# EasyEDA Pro project ProPrj_LED_2025-06-07.epro

# Board LED
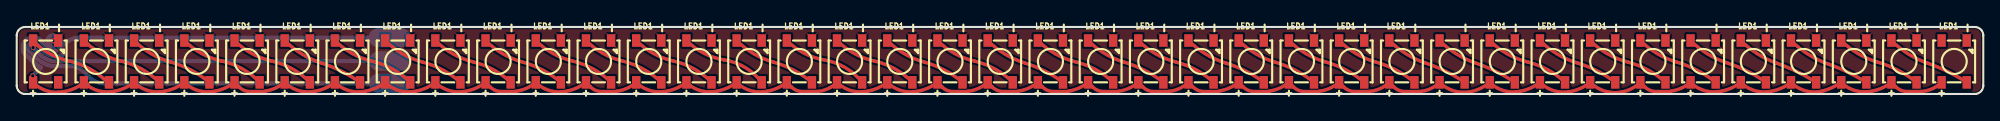
[diagram p0: board, top side]
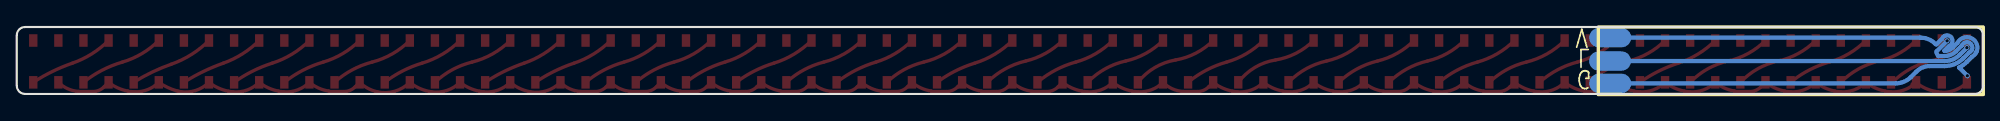
[diagram p1: board, bottom side, seen from below]

Outline 235 x 8 mm; copper layers: Top Layer, Bottom Layer. Coordinates in mm from the lower left corner of the outline.
Outline path: 0,7 0,1 arc(0.29,0.29) 1,0 234,0 arc(234.71,0.29) 235,1 235,7 arc(234.71,7.71) 234,8 1,8 arc(0.29,7.71) 0,7
Stack: Top Layer 0.035mm / Dielectric1 0.71mm FR4 er 4.5 / Bottom Layer 0.035mm

## Design rules (mm)
template: 自定义配置
spacing copperThickness1oz (default): track to track 0.1, other pairs 0.1 to 0.1
track width copperThickness1oz (default): min 0.1, default 0.2, max 2.54
track width copperThickness2oz: min 0.203, default 0.254, max 2.54
differential pair differentialPair (default): width min 0.127, default 0.254, max 2.54; gap min 0.152, default 0.152
via viaSize (default): diameter min 0.5, default 0.61, max 10; hole min 0.3, default 0.305, max 6.3

## Placement (name value [footprint] x y rotation side)
LED1  -  [LED-SMD_4P-L5.0-W5.0-BL_XL-5050RGBC]  9.52 3.89 0 top
LED1#2  -  [LED-SMD_4P-L5.0-W5.0-BL_XL-5050RGBC]  3.46 3.89 0 top
LED1#3  -  [LED-SMD_4P-L5.0-W5.0-BL_XL-5050RGBC]  15.52 3.89 0 top
LED1#4  -  [LED-SMD_4P-L5.0-W5.0-BL_XL-5050RGBC]  21.52 3.89 0 top
LED1#5  -  [LED-SMD_4P-L5.0-W5.0-BL_XL-5050RGBC]  27.52 3.89 0 top
LED1#6  -  [LED-SMD_4P-L5.0-W5.0-BL_XL-5050RGBC]  33.52 3.89 0 top
LED1#7  -  [LED-SMD_4P-L5.0-W5.0-BL_XL-5050RGBC]  39.53 3.89 0 top
LED1#8  -  [LED-SMD_4P-L5.0-W5.0-BL_XL-5050RGBC]  45.53 3.89 0 top
LED1#9  -  [LED-SMD_4P-L5.0-W5.0-BL_XL-5050RGBC]  51.53 3.89 0 top
LED1#10  -  [LED-SMD_4P-L5.0-W5.0-BL_XL-5050RGBC]  57.53 3.89 0 top
LED1#11  -  [LED-SMD_4P-L5.0-W5.0-BL_XL-5050RGBC]  63.53 3.89 0 top
LED1#12  -  [LED-SMD_4P-L5.0-W5.0-BL_XL-5050RGBC]  69.53 3.89 0 top
LED1#13  -  [LED-SMD_4P-L5.0-W5.0-BL_XL-5050RGBC]  75.53 3.89 0 top
LED1#14  -  [LED-SMD_4P-L5.0-W5.0-BL_XL-5050RGBC]  81.53 3.89 0 top
LED1#15  -  [LED-SMD_4P-L5.0-W5.0-BL_XL-5050RGBC]  87.53 3.89 0 top
LED1#16  -  [LED-SMD_4P-L5.0-W5.0-BL_XL-5050RGBC]  93.53 3.89 0 top
LED1#17  -  [LED-SMD_4P-L5.0-W5.0-BL_XL-5050RGBC]  99.53 3.89 0 top
LED1#18  -  [LED-SMD_4P-L5.0-W5.0-BL_XL-5050RGBC]  105.53 3.89 0 top
LED1#19  -  [LED-SMD_4P-L5.0-W5.0-BL_XL-5050RGBC]  111.53 3.89 0 top
LED1#20  -  [LED-SMD_4P-L5.0-W5.0-BL_XL-5050RGBC]  117.53 3.89 0 top
LED1#21  -  [LED-SMD_4P-L5.0-W5.0-BL_XL-5050RGBC]  123.53 3.89 0 top
LED1#22  -  [LED-SMD_4P-L5.0-W5.0-BL_XL-5050RGBC]  129.53 3.89 0 top
LED1#23  -  [LED-SMD_4P-L5.0-W5.0-BL_XL-5050RGBC]  135.53 3.89 0 top
LED1#24  -  [LED-SMD_4P-L5.0-W5.0-BL_XL-5050RGBC]  141.53 3.89 0 top
LED1#25  -  [LED-SMD_4P-L5.0-W5.0-BL_XL-5050RGBC]  147.53 3.89 0 top
LED1#26  -  [LED-SMD_4P-L5.0-W5.0-BL_XL-5050RGBC]  153.53 3.89 0 top
LED1#27  -  [LED-SMD_4P-L5.0-W5.0-BL_XL-5050RGBC]  159.53 3.89 0 top
LED1#28  -  [LED-SMD_4P-L5.0-W5.0-BL_XL-5050RGBC]  165.53 3.89 0 top
LED1#29  -  [LED-SMD_4P-L5.0-W5.0-BL_XL-5050RGBC]  171.53 3.89 0 top
LED1#30  -  [LED-SMD_4P-L5.0-W5.0-BL_XL-5050RGBC]  177.53 3.89 0 top
LED1#31  -  [LED-SMD_4P-L5.0-W5.0-BL_XL-5050RGBC]  183.53 3.89 0 top
LED1#32  -  [LED-SMD_4P-L5.0-W5.0-BL_XL-5050RGBC]  189.53 3.89 0 top
LED1#33  -  [LED-SMD_4P-L5.0-W5.0-BL_XL-5050RGBC]  195.53 3.89 0 top
LED1#34  -  [LED-SMD_4P-L5.0-W5.0-BL_XL-5050RGBC]  201.53 3.89 0 top
LED1#35  -  [LED-SMD_4P-L5.0-W5.0-BL_XL-5050RGBC]  207.53 3.89 0 top
LED1#36  -  [LED-SMD_4P-L5.0-W5.0-BL_XL-5050RGBC]  213.53 3.89 0 top
LED1#37  -  [LED-SMD_4P-L5.0-W5.0-BL_XL-5050RGBC]  219.53 3.89 0 top
LED1#38  -  [LED-SMD_4P-L5.0-W5.0-BL_XL-5050RGBC]  225.53 3.89 0 top
LED1#39  -  [LED-SMD_4P-L5.0-W5.0-BL_XL-5050RGBC]  231.53 3.89 0 top
NOREF  -  [Pad_e3859]  44.6 3.94 0 top
NOREF#2  -  [Pad_e305]  44.58 1.27 0 top
NOREF#3  -  [Pad_e306]  44.58 6.73 0 top

## Footprints (pads in the part's own frame, mm; a bottom-side part is the same pattern mirrored in y, then rotated)
LED-SMD_4P-L5.0-W5.0-BL_XL-5050RGBC
  rect 1x1.5 smd: 1(-1.5,-2.5) 2(1.5,-2.5) 3(1.5,2.5) 4(-1.5,2.5)
Pad_e305
  oval 5x2.3 smd far side: 1(0,0)
Pad_e306
  oval 5x2.3 smd far side: 2(0,0)
Pad_e3859
  rrect 5x2.3 smd far side: 1(0,0)

## Nets
GND: LED1.3 LED1#2.3 LED1#3.3 LED1#4.3 LED1#5.3 LED1#6.3 LED1#7.3 LED1#8.3 LED1#9.3 LED1#10.3 LED1#11.3 LED1#12.3 LED1#13.3 LED1#14.3 LED1#15.3 LED1#16.3 LED1#17.3 LED1#18.3 LED1#19.3 LED1#20.3 LED1#21.3 LED1#22.3 LED1#23.3 LED1#24.3 LED1#25.3 LED1#26.3 LED1#27.3 LED1#28.3 LED1#29.3 LED1#30.3 LED1#31.3 LED1#32.3 LED1#33.3 LED1#34.3 LED1#35.3 LED1#36.3 LED1#37.3 LED1#38.3 LED1#39.3 NOREF#2.1
VCC: LED1.1 LED1#2.1 LED1#3.1 LED1#4.1 LED1#5.1 LED1#6.1 LED1#7.1 LED1#8.1 LED1#9.1 LED1#10.1 LED1#11.1 LED1#12.1 LED1#13.1 LED1#14.1 LED1#15.1 LED1#16.1 LED1#17.1 LED1#18.1 LED1#19.1 LED1#20.1 LED1#21.1 LED1#22.1 LED1#23.1 LED1#24.1 LED1#25.1 LED1#26.1 LED1#27.1 LED1#28.1 LED1#29.1 LED1#30.1 LED1#31.1 LED1#32.1 LED1#33.1 LED1#34.1 LED1#35.1 LED1#36.1 LED1#37.1 LED1#38.1 LED1#39.1 NOREF#3.2

Pads without a net: LED1 2 4; LED1#2 2 4; LED1#3 2 4; LED1#4 2 4; LED1#5 2 4; LED1#6 2 4; LED1#7 2 4; LED1#8 2 4; LED1#9 2 4; LED1#10 2 4; LED1#11 2 4; LED1#12 2 4; LED1#13 2 4; LED1#14 2 4; LED1#15 2 4; LED1#16 2 4; LED1#17 2 4; LED1#18 2 4; LED1#19 2 4; LED1#20 2 4; LED1#21 2 4; LED1#22 2 4; LED1#23 2 4; LED1#24 2 4; LED1#25 2 4; LED1#26 2 4; LED1#27 2 4; LED1#28 2 4; LED1#29 2 4; LED1#30 2 4; LED1#31 2 4; LED1#32 2 4; LED1#33 2 4; LED1#34 2 4; LED1#35 2 4; LED1#36 2 4; LED1#37 2 4; LED1#38 2 4; LED1#39 2 4; NOREF 1

## Via types
v1: diameter 0.6, hole 0.4, Top Layer to Bottom Layer, 3 vias

## Routing (per net, layer and track width the routed paths; a pad name or vN(x,y) marks a point on that pad's centre or on a via; arc(x,y) is an arc through that point)
GND: length 52.3
  Bottom Layer w0.5: NOREF#2.1 10.45,1.27 arc(9.48,1.46) 8.65,2.01 7.99,2.67 arc(7.26,3.16) 6.4,3.34 4.61,3.34 arc(3.41,3.57) 2.39,4.26 1.71,4.94 arc(1.5,5.08) 1.36,5.29 arc(1.71,6.14) 2.56,5.79 3.24,5.1 arc(3.87,4.68) 4.61,4.54 5.37,4.54 arc(5.54,4.78) 5.59,5.07 v1(4.32,6.35)
VCC: length 304.2
  Top Layer w0.4: LED1.1 arc(8.18,1.24) 8.34,1.1 arc(9.62,0.42) 11.05,0.25 arc(11.22,0.27) 11.39,0.29 11.52,0.29 arc(11.62,0.3) 11.71,0.34 arc(12.93,0.73) LED1#3.1 arc(15.4,0.5) 17.02,0.25 arc(17.2,0.27) 17.38,0.29 17.52,0.29 arc(17.62,0.3) 17.71,0.34 arc(18.93,0.73) LED1#4.1 arc(21.39,0.51) 22.99,0.25 arc(23.18,0.27) 23.37,0.29 23.52,0.29 arc(23.62,0.3) 23.71,0.34 arc(24.93,0.73) LED1#5.1 26.58,0.84 arc(27.19,0.43) 27.91,0.29 29.52,0.29 arc(29.63,0.3) 29.72,0.35 arc(30.94,0.72) LED1#6.1 arc(33.42,0.49) 35.05,0.25 arc(35.22,0.27) 35.39,0.29 35.53,0.29 arc(35.62,0.3) 35.71,0.34 arc(36.93,0.73) LED1#7.1 arc(39.4,0.5) 41.02,0.25 arc(41.2,0.27) 41.38,0.29 41.53,0.29 arc(41.62,0.3) 41.71,0.34 arc(42.93,0.73) LED1#8.1 arc(45.39,0.51) 46.99,0.25 arc(47.18,0.27) 47.37,0.29 47.53,0.29 arc(47.62,0.3) 47.71,0.34 arc(48.93,0.73) LED1#9.1 arc(51.43,0.49) 53.09,0.25 arc(53.25,0.27) 53.41,0.29 53.53,0.29 arc(53.62,0.3) 53.7,0.33 arc(54.93,0.72) LED1#10.1 56.58,0.84 arc(57.19,0.43) 57.91,0.29 59.53,0.29 arc(59.61,0.3) 59.7,0.33 arc(60.94,0.69) LED1#11.1 arc(63.4,0.5) 65.02,0.25 arc(65.2,0.27) 65.38,0.29 65.53,0.29 arc(65.62,0.3) 65.71,0.34 arc(66.93,0.73) LED1#12.1 68.58,0.84 arc(69.19,0.43) 69.91,0.29 71.53,0.29 arc(71.6,0.3) 71.68,0.32 arc(72.93,0.68) LED1#13.1 arc(75.37,0.51) 76.96,0.25 arc(77.16,0.27) 77.36,0.29 77.53,0.29 arc(77.62,0.3) 77.71,0.34 arc(78.93,0.73) LED1#14.1 arc(81.36,0.52) 82.93,0.25 arc(83.14,0.27) 83.36,0.29 83.53,0.29 arc(83.62,0.3) 83.71,0.34 arc(84.93,0.73) LED1#15.1 arc(87.46,0.47) 89.15,0.25 arc(89.3,0.27) 89.45,0.29 89.53,0.29 arc(89.61,0.3) 89.69,0.33 arc(90.92,0.72) LED1#16.1 92.58,0.84 arc(93.19,0.43) 93.91,0.29 95.53,0.29 arc(95.56,0.29) 95.59,0.29 arc(96.91,0.62) LED1#17.1 arc(99.37,0.51) 100.97,0.25 arc(101.16,0.27) 101.36,0.29 101.53,0.29 arc(101.62,0.3) 101.71,0.34 arc(102.93,0.73) LED1#18.1 arc(105.42,0.49) 107.06,0.25 arc(107.23,0.27) 107.4,0.29 107.53,0.29 arc(107.62,0.3) 107.71,0.34 arc(108.93,0.72) LED1#19.1 110.58,0.84 arc(111.19,0.43) 111.91,0.29 113.53,0.29 arc(113.6,0.29) 113.67,0.32 arc(114.93,0.67) LED1#20.1 116.58,0.84 arc(117.19,0.43) 117.91,0.29 119.53,0.29 arc(119.62,0.3) 119.71,0.34 arc(120.94,0.71) LED1#21.1 122.58,0.84 arc(123.19,0.43) 123.91,0.29 125.53,0.29 arc(125.63,0.3) 125.72,0.35 arc(126.94,0.71) LED1#22.1 128.58,0.84 arc(129.19,0.43) 129.91,0.29 131.53,0.29 arc(131.61,0.3) 131.7,0.33 arc(132.94,0.69) LED1#23.1 134.58,0.84 arc(135.19,0.43) 135.91,0.29 137.53,0.29 arc(137.58,0.29) 137.62,0.3 arc(138.92,0.64) LED1#24.1 140.58,0.84 arc(141.19,0.43) 141.91,0.29 143.53,0.29 arc(143.64,0.31) 143.74,0.36 arc(144.95,0.73) LED1#25.1 146.58,0.84 arc(147.19,0.43) 147.91,0.29 149.53,0.29 arc(149.63,0.3) 149.72,0.35 arc(150.94,0.71) LED1#26.1 152.58,0.84 arc(153.19,0.43) 153.91,0.29 155.53,0.29 arc(155.61,0.3) 155.69,0.33 arc(156.94,0.69) LED1#27.1 158.58,0.84 arc(159.19,0.43) 159.91,0.29 161.53,0.29 arc(161.57,0.29) 161.62,0.3 arc(162.92,0.64) LED1#28.1 164.58,0.84 arc(165.19,0.43) 165.91,0.29 167.53,0.29 arc(167.56,0.29) 167.59,0.29 arc(168.91,0.61) LED1#29.1 arc(171.68,0.38) 173.61,0.25 arc(174.89,0.66) LED1#30.1 arc(177.48,0.47) 179.2,0.25 arc(179.33,0.27) 179.47,0.29 179.53,0.29 arc(179.6,0.3) 179.68,0.32 arc(180.92,0.71) LED1#31.1 arc(183.59,0.42) 185.42,0.25 arc(186.8,0.64) LED1#32.1 arc(189.82,0.33) 191.9,0.25 arc(193.04,0.67) LED1#33.1 194.58,0.84 arc(195.19,0.43) 195.91,0.29 197.53,0.29 arc(197.63,0.3) 197.72,0.34 arc(198.94,0.71) LED1#34.1 arc(201.43,0.49) 203.07,0.25 arc(203.24,0.27) 203.4,0.29 203.53,0.29 arc(203.62,0.3) 203.7,0.34 arc(204.93,0.72) LED1#35.1 arc(207.47,0.47) 209.17,0.25 arc(209.31,0.27) 209.46,0.29 209.53,0.29 arc(209.61,0.3) 209.69,0.33 arc(210.92,0.72) LED1#36.1 arc(213.62,0.42) 215.49,0.29 215.53,0.29 arc(215.61,0.3) 215.69,0.33 arc(215.79,0.35) 215.9,0.38 arc(217,0.8) LED1#37.1 arc(219.32,0.53) 220.85,0.25 arc(221.1,0.26) 221.35,0.29 221.53,0.29 arc(221.62,0.3) 221.71,0.34 arc(222.93,0.73) LED1#38.1 224.58,0.84 arc(225.19,0.43) 225.91,0.29 227.53,0.29 arc(227.57,0.29) 227.61,0.3 arc(228.91,0.63) LED1#39.1 ; 8.01,1.34 arc(6.91,0.68) 5.69,0.29 arc(5.6,0.25) 5.51,0.24 5.37,0.24 arc(5.2,0.22) 5.03,0.2 arc(3.6,0.37) 2.32,1.05
  Top Layer w0.6: 8.34,1.1 arc(8.37,1.12) 8.41,1.13
  Bottom Layer w0.5: NOREF#3.2 7.51,6.73 arc(6.54,6.54) 5.72,5.99 5.67,5.94 arc(5.62,5.93) 5.58,5.94 4.92,6.6 arc(4.78,6.81) 4.57,6.95 arc(3.72,6.6) 4.07,5.75 4.63,5.19 arc(4.63,5.16) 4.61,5.14 arc(4.1,5.24) 3.66,5.53 3.05,6.14 arc(1.42,6.67) 0.8,5.06 arc(1.02,4.71) 1.36,4.44 1.97,3.83 arc(2.4,3.46) 2.89,3.16 v1(1.91,2.17)
(no net): length 438.6
  Top Layer w0.3: LED1.4 arc(8.26,6.17) 8.49,5.95
  Top Layer w0.4: LED1#7.2 arc(38.82,2.71) 36.45,3.68 arc(34.08,4.77) LED1#6.4 ; LED1#35.2 arc(206.84,2.72) 204.47,3.68 arc(202.09,4.77) LED1#34.4 ; LED1#28.4 arc(166.06,4.78) 168.4,3.68 arc(170.79,2.7) LED1#29.2 ; LED1#29.4 arc(172.04,4.79) 174.37,3.68 arc(176.77,2.69) LED1#30.2 ; LED1#35.4 arc(208.02,4.8) 210.31,3.68 arc(212.73,2.67) LED1#36.2 ; LED1#23.4 arc(136.12,4.79) 138.56,3.81 arc(140.94,2.88) LED1#24.2 ; LED1#18.4 arc(106.07,4.81) 108.46,3.81 arc(110.87,2.85) LED1#19.2 ; LED1#8.2 arc(44.9,2.98) 42.42,3.94 arc(40.05,4.86) LED1#7.4 ; LED1#16.4 arc(94.09,4.88) 96.52,4.06 arc(99.02,3.14) LED1#17.2 ; LED1#11.2 arc(62.87,2.85) 60.45,3.81 arc(58.07,4.81) LED1#10.4 ; LED1#38.4 arc(226.03,4.79) 228.35,3.68 arc(230.76,2.68) LED1#39.2 ; LED1#9.4 arc(52.14,4.78) 54.61,3.81 arc(56.98,2.89) LED1#10.2 ; LED1#13.4 arc(76.08,4.85) 78.49,3.94 arc(80.94,3) LED1#14.2 ; LED1#22.4 arc(130.02,4.83) 132.33,3.81 arc(134.79,2.81) LED1#23.2 ; LED1#12.2 arc(68.9,2.98) 66.42,3.94 arc(64.05,4.86) LED1#11.4 ; LED1#32.4 arc(190.11,4.8) 192.53,3.81 arc(194.92,2.87) LED1#33.2 ; LED1#15.4 arc(88.06,4.82) 90.42,3.81 arc(92.85,2.84) LED1#16.2 ; LED1#20.4 arc(118.11,4.76) 120.52,3.68 arc(122.87,2.73) LED1#21.2 ; LED1#4.2 arc(20.85,2.84) 18.41,3.81 arc(16.06,4.82) LED1#3.4 ; LED1#17.4 arc(100.08,4.84) 102.49,3.94 arc(104.94,3) LED1#18.2 ; LED1#12.4 arc(70.04,4.86) 72.39,3.94 arc(74.88,2.97) LED1#13.2 ; LED1#32.2 arc(188.9,2.74) 186.56,3.68 arc(184.13,4.75) LED1#31.4 ; LED1#4.4 arc(22.09,4.84) 24.51,3.94 arc(26.96,3) LED1#5.2 ; LED1#37.2 arc(218.84,2.6) 216.53,3.55 arc(214.12,4.72) LED1#36.4 ; LED1#27.4 arc(160.06,4.82) 162.43,3.81 arc(164.86,2.84) LED1#28.2 ; LED1#22.2 arc(128.98,2.89) 126.62,3.81 arc(124.14,4.78) LED1#21.4 ; LED1#25.2 arc(146.88,2.73) 144.53,3.68 arc(142.11,4.76) LED1#24.4 ; LED1#5.4 arc(28.08,4.85) 30.48,3.94 arc(32.94,2.99) LED1#6.2 ; LED1#27.2 arc(158.88,2.85) 156.46,3.81 arc(154.08,4.81) LED1#26.4 ; LED1#31.2 arc(182.97,2.89) 180.59,3.81 arc(178.13,4.79) LED1#30.4 ; 2.32,5.95 arc(4.18,4.7) 6.28,3.94 arc(8.75,2.99) 10.86,1.39 ; LED1#37.4 arc(220.04,4.83) 222.38,3.81 arc(224.82,2.83) LED1#38.2 ; LED1#20.2 arc(116.9,2.98) 114.43,3.94 arc(112.06,4.86) LED1#19.4 ; LED1#26.2 arc(152.81,2.82) 150.37,3.81 arc(148.03,4.83) LED1#25.4 ; LED1#3.2 arc(14.91,2.99) 12.45,3.94 arc(10.35,4.7) 8.49,5.95 arc(8.26,6.17) LED1.4 ; LED1#8.4 arc(46.1,4.8) 48.51,3.81 arc(50.91,2.86) LED1#9.2 ; LED1#14.4 arc(82.12,4.87) 84.58,4.06 arc(87.06,3.16) LED1#15.2 ; LED1#34.2 arc(200.82,2.83) 198.37,3.81 arc(196.04,4.83) LED1#33.4
  Bottom Layer w0.5: v1(1.96,5.54) 2.82,4.68 arc(3.64,4.13) 4.61,3.94 NOREF.1

## Copper pours and planes (outline as drawn; the poured copper is in the pictures)
GND on Top Layer: -5.21,9.35 234.83,9.35 234.83,-1.46 -5.21,-1.46

## Text on the board
Bottom Silkscreen Layer: L | G | V

# Board Esp32c3
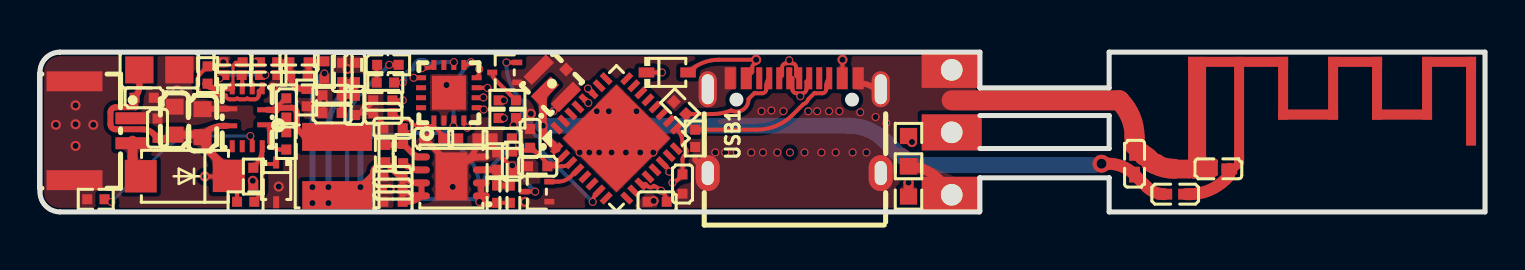
[diagram p2: board, top side]
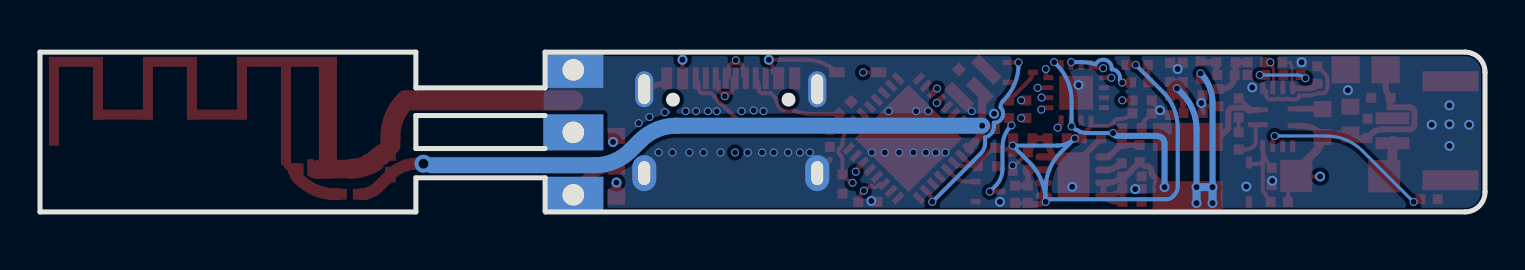
[diagram p3: board, bottom side, seen from below]

Outline 72.26 x 8 mm; copper layers: Top Layer, Inner1, Inner2, Bottom Layer. Coordinates in mm from the lower left corner of the outline.
Outline path: 47,3.17 53.47,3.17 53.47,4.83 47,4.83 ; 0,7 arc(0.29,7.71) 1,8 47.01,8 47.01,6.22 arc(47.01,6.21) 47,6.21 53.47,6.21 53.47,8 72.26,8 72.26,0 53.47,0 53.47,1.71 47,1.71 47,0.04 arc(47,0.02) 46.98,0 1,0 arc(0.29,0.29) 0,1 0,7
Stack: Top Layer 0.035mm 外层铜厚1oz / Dielectric1 0.2133mm 7628 RC49% 8.6mil / Inner1 0.035mm 内层铜厚 / Dielectric2 0.2133mm 1.1mm H/HOZ Copper / Inner2 0.035mm 内层铜厚 / Dielectric3 0.2133mm 7628 RC49% 8.6mil / Bottom Layer 0.035mm 外层铜厚1oz

## Design rules (mm)
net DATA+: DP1
net DATA-: DP1
net TX: DP2
net RX: DP2
template: 自定义配置
spacing copperThickness1oz: track to track 0.102, other pairs 0.152 to 0.3
spacing copperThickness2oz (default): track to track 0.1, other pairs 0.1 to 0.3
track width copperThickness1oz: min 0.1, default 0.254, max 2.54
track width copperThickness2oz (default): min 0.1, default 0.254, max 2.54
differential pair differentialPair (default): width min 0.127, default 0.254, max 2.54; gap min 0.152, default 0.152
via viaSize (default): diameter min 0.5, default 0.61, max 10; hole min 0.3, default 0.305, max 6.3

## Placement (name value [footprint] x y rotation side)
C2  22uF  [C0805]  5.97 7.11 0 top
C3  -  [C0402]  5.21 5.71 180 top
C3#2  -  [C0402]  5.88 4.19 270 top
C4  -  [C0603]  6.73 4.57 90 top
C4#2  -  [C0603]  8.13 4.44 90 top
C5  1uF  [C0402]  9.65 7.49 0 top
C6  100nF  [C0402]  12.32 5.21 270 top
C7  100nF  [C0402]  12.95 7.49 0 top
C8  22uF  [C0402]  15.75 5.33 270 top
C9  22uF  [C0402]  14.6 5.84 0 top
C10  22uF  [C0402]  14.6 4.95 0 top
C11  22uF  [C0402]  15.11 6.98 90 top
C12  22uF  [C0402]  15.75 6.98 90 top
C13  1nF  [C0402]  18.16 2.92 90 top
C14  4.7uF  [C0402]  17.65 1.78 0 top
C15  2.2uF  [C0402]  17.65 1.14 0 top
C16  2.2uF  [C0402]  17.65 0.51 0 top
C17  -  [C0402]  23.11 3.68 0 top
C17#2  -  [C0402]  17.15 4.94 0 top
C17#3  -  [C0402]  17.14 5.59 0 top
C18  -  [C0402]  23.62 2.54 90 top
C18#2  -  [C0402]  17.65 4.19 0 top
C19  -  [C0402]  19.68 3.68 0 top
C19#2  -  [C0402]  24.89 2.29 0 top
C19#3  -  [C0402]  24.51 3.68 270 top
C20  -  [C0402]  21.4 3.68 180 top
C20#2  -  [C0402]  32.13 1.4 90 top
C21  100nF  [C0402]  30.86 0.51 0 top
C22  2.4pF  [C0402#2]  58.93 2.16 0 top
C23  8.2pF  [C0402#2]  54.74 2.41 90 top
CN1  WAFER-GH1.25-2PWB  [CONN-TH_2P-P1.25_XUNPU_WAFER-GH1.25-2PWB]  3.17 4.06 270 top
D1  B5819WS  [SOD-323_L1.7-W1.3-LS2.5-FD]  31.37 6.98 180 top
D2  SS34  [SMA_L4.3-W2.6-LS5.0-FD]  7.24 1.79 0 top
D3  BZT52C5V1S-7-F  [SOD-323_L1.8-W1.3-LS2.5-RD]  11.81 1.52 270 top
L1  15uH  [IND-SMD_L4.0-W4.0]  14.86 2.29 270 top
L2  1.5nH  [L0402]  56.77 0.89 0 top
LED1  NCD0402G1  [LED0402-RD]  17.4 7.37 0 top
NOREF  -  [Pad_e1279]  45.59 7.11 270 top
NOREF#2  -  [Pad_e1296]  45.59 0.86 270 top
NOREF#3  -  [Pad_e1295]  45.59 3.98 270 top
Q2  MMBT2222ATT1G  [SC-75-3_L1.6-W0.8-P1.00-LS1.6-BR]  23.24 6.98 0 top
Q3  MMBT2222ATT1G  [SC-75-3_L1.6-W0.8-P1.00-LS1.6-BR]  24.85 1.02 0 top
R3  -  [R0402]  8.38 6.86 90 top
R3#2  -  [R0402]  10.29 0.51 0 top
R4  20kΩ  [R0402]  10.67 1.78 90 top
R5  0Ω  [R0402]  12.32 3.56 90 top
R6  20kΩ  [R0402]  11.43 7.49 0 top
R7  41.2kΩ  [R0402]  12.95 6.86 0 top
R8  7.68kΩ  [R0402]  13.33 5.72 270 top
R9  10Ω  [R0402]  14.22 7.11 270 top
R10  10Ω  [R0402]  9.65 6.86 180 top
R11  76.8kΩ  [R0402]  11.44 6.86 0 top
R12  100kΩ  [R0402]  2.79 0.63 0 top
R13  100kΩ  [R0402]  17.27 2.92 90 top
R14  -  [R0402]  22.86 2.55 90 top
R14#2  -  [R0402]  23.37 5.59 180 top
R15  -  [R0402]  23.49 0.89 90 top
R15#2  -  [R0402]  23.37 4.7 180 top
R16  -  [R0402]  22.86 0.89 90 top
R16#2  -  [R0402]  17.27 6.48 0 top
R17  5.1kΩ  [R0402]  32 5.21 135 top
R18  5.1kΩ  [R0402]  32.77 3.68 90 top
R19  0Ω  [R0603]  43.43 3.05 90 top
R20  0Ω  [R0603]  43.43 1.52 90 top
RF1  KH-IPEX4-2020  [IPEX4-SMD_4P-L1.8-W1.7-LS2.0-L_KH-IPEX4-2020]  25.78 6.6 45 top
U1  MP4573GQBE-Z  [QFN-12_L3.0-W2.5-P0.5_MPQ4572]  10.41 4.74 180 top
U2  MP20051DQ-LF-Z  [TDFN-8_L3.0-W3.0-P0.65-BL-EP]  20.57 1.78 90 top
U3  CH343P  [TQFN-16_L3.0-W3.0-P0.50-BL-EP1.7]  20.45 5.97 0 top
U4  ESP32-C3  [QFN-32_L5.0-W5.0-P0.50-TL-EP3.7]  28.83 3.68 45 top
U5  天线  [2.4Ghz平面倒F天线]  64.52 5.46 0 top
USB1  TYPE-C 16PIN 2MD(073)  [USB-C-SMD_TYPE-C-6PIN-2MD-073]  37.72 4.32 0 top

## Footprints (pads in the part's own frame, mm; a bottom-side part is the same pattern mirrored in y, then rotated)
2.4Ghz平面倒F天线
  rect 0.9x0.5 smd: 1(-6.651,-2.846)
  rect 0.5x0.5 smd: 2(-4.551,-2.846)
C0402
  rect 0.5x0.5 smd: 1(-0.481,0) 2(0.481,0)
C0402#2
  rect 0.79x0.54 smd: 1(-0.545,0) 2(0.545,0)
C0603
  rect 0.8x0.9 smd: 1(-0.7,0) 2(0.7,0)
C0805
  rect 1.41x1.35 smd: 1(-1,0) 2(1,0)
CONN-TH_2P-P1.25_XUNPU_WAFER-GH1.25-2PWB
  rect 0.6x1.7 smd: 1(-0.625,1.45) 2(0.625,1.45)
  rect 1x2.8 smd: 3(-2.475,-1.45) 4(2.475,-1.45)
IND-SMD_L4.0-W4.0
  rect 1.4x3.5 smd: 1(-1.47,0) 2(1.444,0.009)
IPEX4-SMD_4P-L1.8-W1.7-LS2.0-L_KH-IPEX4-2020
  rect 1.4x0.6 smd: 1(-0.748,0)
  rect 1.58x0.58 smd: 2(-0.228,-0.96) 4(-0.228,0.96)
  rect 0.5x0.5 smd: 3(0.748,0)
L0402
  rect 0.79x0.54 smd: 1(-0.545,0) 2(0.545,0)
LED0402-RD
  rect 0.5x0.5 smd: 1(-0.538,0) 2(0.538,0)
Pad_e1279
  rect 1.8x3 hole 1.08: 1(0,0)
Pad_e1295
  rect 1.8x3 hole 1.08: 2(0,0)
Pad_e1296
  rect 1.8x3 hole 1.08: 3(0,0)
QFN-12_L3.0-W2.5-P0.5_MPQ4572
  rect 1x0.25 smd: 1(-0.95,0.375) 2(-0.95,-0.375) 7(1.05,-0.425) 8(1.05,0.425)
  rect 0.25x0.6 smd: 3(-0.7,-1.45) 4(-0.2,-1.45) 5(0.3,-1.45) 6(0.8,-1.45) 9(0.8,1.45) 10(0.3,1.45) 11(-0.2,1.45) 12(-0.7,1.45)
QFN-32_L5.0-W5.0-P0.50-TL-EP3.7
  rect 0.65x0.28 smd: 1(-2.478,1.75) 2(-2.478,1.25) 3(-2.478,0.75) 4(-2.478,0.25) 5(-2.478,-0.25) 6(-2.478,-0.75) 7(-2.478,-1.25) 8(-2.478,-1.75) 17(2.478,-1.75) 18(2.478,-1.25) 19(2.478,-0.75) 20(2.478,-0.25) 21(2.478,0.25) 22(2.478,0.75) 23(2.478,1.25) 24(2.478,1.75)
  rect 0.28x0.65 smd: 9(-1.75,-2.478) 10(-1.25,-2.478) 11(-0.75,-2.478) 12(-0.25,-2.478) 13(0.25,-2.478) 14(0.75,-2.478) 15(1.25,-2.478) 16(1.75,-2.478) 25(1.75,2.478) 26(1.25,2.478) 27(0.75,2.478) 28(0.25,2.478) 29(-0.25,2.478) 30(-0.75,2.478) 31(-1.25,2.478) 32(-1.75,2.478)
  rect 3.8x3.8 smd: 33(0,0)
R0402
  rect 0.5x0.5 smd: 1(-0.433,0) 2(0.433,0)
R0603
  rect 0.806x0.864 smd: 1(-0.753,0) 2(0.753,0)
SC-75-3_L1.6-W0.8-P1.00-LS1.6-BR
  rect 0.5x0.28 smd: 1(0.625,-0.5) 2(0.625,0.5) 3(-0.625,0)
SMA_L4.3-W2.6-LS5.0-FD
  rect 1.6x1.62 smd: 1(-2.201,-0.009) 2(2.201,0.009)
SOD-323_L1.7-W1.3-LS2.5-FD
  rect 0.78x0.5 smd: 1(-1.04,0) 2(1.04,0)
SOD-323_L1.8-W1.3-LS2.5-RD
  rect 0.6x0.3 smd: 1(-0.952,-0.002) 2(1.04,0)
TDFN-8_L3.0-W3.0-P0.65-BL-EP
  oval 0.35x0.84 smd: 1(-0.975,-1.495) 2(-0.325,-1.495) 3(0.325,-1.495) 4(0.975,-1.495) 5(0.975,1.495) 6(0.325,1.495) 7(-0.325,1.495) 8(-0.975,1.495)
  rect 2.4x1.6 smd: 9(0,0)
TQFN-16_L3.0-W3.0-P0.50-BL-EP1.7
  rect 0.25x0.5 smd: 1(-0.749,-1.39) 2(-0.248,-1.39) 3(0.252,-1.39) 4(0.751,-1.39) 9(0.75,1.39) 10(0.25,1.39) 11(-0.25,1.39) 12(-0.749,1.39)
  rect 0.5x0.25 smd: 5(1.39,-0.75) 6(1.39,-0.25) 7(1.39,0.25) 8(1.39,0.75) 13(-1.39,0.75) 14(-1.39,0.25) 15(-1.39,-0.25) 16(-1.39,-0.75)
  rect 1.7x1.7 smd: 17(0.001,0)
USB-C-SMD_TYPE-C-6PIN-2MD-073
  rect 0.55x1.1 smd: 1(-3.2,2.375) 2(-2.4,2.375) 11(2.4,2.375) 12(3.2,2.375)
  rect 0.3x1.1 smd: 3(-1.75,2.375) 4(-1.25,2.375) 5(-0.75,2.375) 6(-0.25,2.375) 7(0.25,2.375) 8(0.75,2.375) 9(1.25,2.375) 10(1.75,2.375)
  oval 0.9x1.8 hole 0.6x1.5: 13(-4.325,1.825) 14(4.325,1.825)
  oval 1.2x1.8 hole 0.6x1.2: 13(-4.325,-2.375) 14(4.325,-2.375)

## Nets
GND: C2.2 C3.1 C3#2.1 C4.2 C4#2.2 C5.1 C8.2 C9.1 C10.1 C11.2 C12.2 C14.1 C15.1 C16.1 C17.1 C17#2.1 C17#3.1 C18.1 C18#2.1 C19.1 C19#2.1 C19#3.1 C20.1 C20#2.1 C21.1 C22.1 C23.2 CN1.1 CN1.3 CN1.4 D3.2 NOREF.1 Q2.1 Q3.1 R4.1 R8.2 R11.2 R12.1 R14.2 R17.2 R18.1 RF1.2 RF1.3 RF1.4 U1.7 U2.4 U2.9 U3.2 U3.17 U4.33 U5.1 USB1.1 USB1.12 USB1.13 USB1.14
V3: C17#3.2 U3.6
VCC: CN1.2 D2.1
VCC-5V: D1.1 USB1.2 USB1.11
VCC-M: C5.2 R3.1 U1.6
VIN-DC: C2.1 C3.2 C3#2.2 C4.1 C4#2.1 D1.2 D2.2 R3#2.1 U1.8
ACT#: R16#2.2 U3.10
B1: Q2.3 R14#2.1
B2: Q3.3 R15#2.1
BST: R5.1 U1.1
CC1: R17.1 USB1.4
CC2: R18.2 USB1.10
CCM: R12.2 U1.11
CR1: C6.2 R5.2
DATA+: U3.7 USB1.6 USB1.8
DATA-: U3.8 USB1.5 USB1.7
DTR: R14#2.2 U3.12
EN: D3.1 R3#2.2 R4.2 U1.12
EN1: C13.2 R13.2 U2.5
EN-ESP: Q2.2 U4.7
FB: R6.1 U1.4
FB1: R14.1 R15.2 R16.2 U2.3
FREQ: R10.1 U1.5
GPIO0: Q3.2 U4.4
LAN-IN: C22.2 C23.1 L2.1 L2.2 RF1.1 U4.1 U5.2
LC: NOREF#3.2 U4.14
LED: LED1.1 R16#2.1
NC: U1.9 U1.10
NC1: C13.1 U2.6
OUT-3.3V: C17.2 C17#2.2 C18.2 C19.2 C19#2.2 C19#3.2 C20.2 C20#2.2 C21.2 LED1.2 R15.1 R16.1 R19.2 U2.1 U2.2 U3.1 U4.2 U4.3 U4.11 U4.17
PG: R3.2 U1.3
R3: C7.2 R7.2 R9.1
R6: C7.1 R6.2 R7.1 R8.1
R7: R10.2 R11.1
RTS: R15#2.2 U3.13
RX: U3.5 U4.27
S1: USB1.3
S2: USB1.9
SW: C6.1 L1.1 U1.2
TX: U3.4 U4.28
V: NOREF#2.3 R19.1 R20.2
VOUT-5V: C8.1 C9.2 C10.2 C11.1 C12.1 C14.2 C15.2 C16.2 C18#2.2 L1.2 R9.2 R13.1 R20.1 U2.7 U2.8 U3.3 U3.9

Pads without a net: U3 11 14 15 16; U4 5 6 8 9 10 12 13 15 16 18 19 20 21 22 23 24 25 26 29 30 31 32

## Via types
v1: diameter 0.4, hole 0.3, Top Layer to Bottom Layer, 34 vias
v2: diameter 0.5, hole 0.305, Top Layer to Bottom Layer, 30 vias
v3: diameter 0.4, hole 0.305, Top Layer to Bottom Layer, 38 vias
v4: diameter 0.9, hole 0.5, Top Layer to Bottom Layer, 1 via

## Routing (per net, layer and track width the routed paths; a pad name or vN(x,y) marks a point on that pad's centre or on a via; arc(x,y) is an arc through that point)
GND: length 44.2
  Top Layer w0.2: C22.1 58.74,2.51 ; C22.1 arc(58.24,2.04) 58.09,1.94 ; C22.1 arc(58.07,2.1) 57.8,1.92 ; C22.1 arc(58.44,2.07) 58.46,1.97 58.46,1.91 ; 58.74,2.51 58.64,2.51 ; 58.74,2.51 arc(58.77,2.53) 58.8,2.54 ; 58.8,2.54 58.66,2.54 arc(58.65,2.53) 58.64,2.51 ; 58.8,2.54 58.8,1.91 ; 56.71,2.16 56.83,2.04 arc(56.98,1.94) 57.15,1.91 57.77,1.91 arc(57.78,1.91) 57.8,1.92 ; 58.8,1.91 58.46,1.91 ; 58.8,1.91 arc(58.64,1.8) 58.46,1.76 ; 58.8,1.91 arc(58.62,1.87) 58.46,1.76 ; 58.46,1.91 58.17,1.91 arc(58.13,1.91) 58.09,1.94 ; 58.46,1.91 58.46,1.76 ; R8.2 13.79,5.29 arc(14,5.33) v2(14.19,5.45) ; v2(14.19,5.45) 14.19,5.69 arc(14.17,5.77) C9.1 ; v2(14.19,5.45) 14.19,5.1 arc(14.17,5.02) C10.1 ; v2(16.25,5.09) 16.21,5.04 arc(16,4.9) C8.2 ; v2(16.25,5.09) 16.3,5.09 arc(16.5,5.05) C17#2.1 17,4.6 arc(17.13,4.41) C18#2.1 ; v2(16.25,5.09) 16.6,5.44 arc(16.65,5.51) C17#3.1 ; 58.46,1.76 57.69,1.76 arc(57.67,1.77) 57.66,1.78 ; 58.64,2.51 arc(58.53,2.41) 58.39,2.35 ; 56.77,1.78 57.46,1.78 arc(57.79,1.82) 58.09,1.94 ; 57.8,1.92 57.78,1.91 ; R14.2 23.51,2.33 arc(23.59,2.21) C18.1
  Top Layer w0.3: 32.77,2.61 32.91,2.47 arc(33.27,1.94) 33.39,1.31 ; U1.7 8.39,5.16 arc(8.25,5.19) 8.13,5.27 ; 42.04,5.89 41.85,6.08 arc(41.46,6.35) 40.99,6.44 40.92,6.44 ; 21.18,2.39 21.45,2.66 arc(21.77,3.13) C20.1 C17.1 22.63,3.53 arc(22.69,3.23) R14.2 ; 21.18,2.39 U2.9 arc(20.48,2.27) 20.2,2.69 C19.1 ; 21.18,2.39 arc(21.59,2.66) U2.4
  Top Layer w0.4: 54.74,2.88 54.74,3.34 ; 58.38,2.41 55.83,2.41 55.57,2.16 C22.1
  Top Layer w1: 45.59,5.59 53.98,5.59 53.99,5.57 arc(54.54,4.75) 54.74,3.77 54.74,3.34 ; 55.12,2.92 55.21,2.83 arc(55.41,2.71) 55.54,2.53 ; 55.7,2.43 arc(55.63,2.46) 55.56,2.49 arc(55.55,2.51) 55.54,2.53 ; 55.7,2.43 arc(55.62,2.48) 55.54,2.53 ; 55.7,2.43 arc(55.77,2.42) 55.83,2.41 ; 55.7,2.43 arc(55.75,2.4) 55.79,2.38 arc(56.24,2.21) 56.71,2.16
  vias: v1(23.62,2.33) v1(25.67,5.04) v1(26.99,2.98) v1(27.47,2.98) v1(27.85,5.04) v1(27.96,2.98) v1(28.45,5.04) v1(28.58,2.98) v1(29.3,2.98) v1(29.83,5.04) v1(30.02,2.98) v1(30.67,2.98) v1(33.77,2.98) v1(34.26,2.98) v1(34.85,2.98) v1(35.57,2.98) v1(36.08,5.04) v1(36.15,2.98) v1(36.58,5.08) v1(36.87,2.98) v1(37.18,5.04) v1(38.23,2.98) v1(38.42,5.04) v1(38.86,5.04) v1(39.08,2.98) v1(39.46,5.04) v1(39.79,2.98) v1(39.98,5.04) v1(40.64,2.98) v1(41.02,4.99) v1(41.33,2.98) v1(41.78,4.75) v1(42.32,4.44) v2(0.79,4.36) v2(1.78,5.33) v2(1.78,4.39) v2(1.78,3.3) v2(2.66,4.36) v2(6.86,6.09) v2(9.17,7.49) v2(10.64,1.56) v2(11.64,6.23) v2(11.94,1.27) v2(15.37,7.16) v2(17.49,1.14) v2(20.33,6.35) v2(20.64,1.25) v2(24.26,0.51) v2(24.55,4.92) v2(30.69,0.55)
V3: length 4.6
  Top Layer w0.2: C17#3.2 v3(18.14,5.59)
  Inner2 w0.2: v3(18.14,5.59) 21.83,5.59 arc(22.02,5.63) v3(22.18,5.73)
VCC: length 1.9
  Top Layer w0.5: 4.62,3.57 4.62,2.78 arc(4.73,2.24) D2.1
VCC-5V: length 10.5
  Top Layer w0.2: 40.13,7.6 40.13,6.72 arc(40.13,6.71) 40.12,6.69 ; v2(35.81,7.62) 33.94,7.62 arc(33.11,7.45) 32.41,6.98 ; USB1.2 35.51,6.88 arc(35.57,6.95) 35.62,7.01 35.62,7.24 arc(35.67,7.38) 35.8,7.44 arc(35.81,7.52) 35.81,7.6
  Inner1 w0.2: v2(40.13,7.62) 37.9,7.62 arc(37.9,7.59) 37.9,7.57 arc(37.44,7.17) 37.04,7.62 v2(35.81,7.62)
VCC-M: length 3.1
  Top Layer w0.15: C5.2 9.78,7.49 9.74,7.46 arc(9.68,7.36) 9.65,7.24 9.65,6.28 arc(9.64,6.23) U1.6
  Top Layer w0.3: U1.6 8.82,6.19 arc(8.52,6.25) 8.25,6.42
VIN-DC: length 40.9
  Top Layer w0.2: 30.46,6.98 v3(31.1,6.98) ; R3#2.1 9.85,0.8 arc(9.75,1.35) D2.2 arc(9.4,1.78) 9.36,1.77 v2(8.25,1.77)
  Top Layer w0.3: U1.8 9.2,4.31 arc(8.62,4.2) 8.13,3.87 ; C2.1 4.97,6.3 arc(4.91,5.98) C3.2 arc(4.74,5.48) 4.78,5.24 3.77,5.24 arc(3.6,5.17) 3.52,4.99 3.52,4.39 arc(3.6,4.21) 3.77,4.14 5.14,4.14 arc(5.42,4.08) 5.66,3.92 C3#2.2
  Top Layer w0.4: 8.13,3.87 C4.1 arc(6.48,3.7) 6.18,3.65 5.88,3.65 ; 9.82,1.68 8.48,3.02 arc(8.24,3.35) 8.13,3.75
  Inner1 w0.3: v2(8.25,1.77) 8.91,2.43 arc(9.73,2.98) 10.7,3.17 20.83,3.17 arc(21.06,3.22) 21.26,3.35 arc(21.77,3.69) 22.36,3.81 26.87,3.81 arc(27.85,4) 28.67,4.55 v3(31.1,6.98)
(no net): length 0.7
  Top Layer w0.4: 59.56,2.03 59.85,2.32 arc(59.92,2.42) 59.94,2.54
ACT#: length 3.4
  Bottom Layer w0.2: v3(20.7,7.5) 20.22,7.5 arc(19.84,7.47) 19.48,7.39 arc(18.97,7.6) 18.67,7.14 arc(18.34,6.97) 18.27,6.61 v3(18.14,6.48)
B1: length 1.9
  Top Layer w0.2: R14#2.1 23.53,5.86 arc(23.5,5.89) 23.47,5.92 22.77,6.62 arc(22.66,6.79) Q2.3
B2: length 4.6
  Top Layer w0.2: R15#2.1 23.8,4.62 arc(23.77,4.46) v3(23.68,4.33) ; Q3.3 v3(24.77,1.02)
  Bottom Layer w0.2: v3(24.77,1.02) 24.49,1.29 arc(24.22,1.69) 24.13,2.16 24.13,3.26 arc(24.01,3.84) v3(23.68,4.33)
BST: length 1.9
  Top Layer w0.2: 11.46,4.36 11.46,3.53 arc(11.49,3.4) 11.56,3.3 arc(11.75,3.17) 11.99,3.12 R5.1
CC1: length 5.3
  Top Layer w0.2: R17.1 33.27,4.9 arc(33.39,4.89) 33.52,4.9 33.62,4.9 arc(34.1,4.95) 34.57,5.08 arc(35.16,5.12) 35.43,5.65 35.74,5.96 arc(35.78,5.95) 35.82,5.94 36.12,5.94 arc(36.26,6) 36.32,6.14 36.32,6.33 arc(36.36,6.53) USB1.4
CC2: length 7.9
  Top Layer w0.2: R18.2 35.84,4.12 arc(36.81,4.31) 37.64,4.86 38.16,5.39 arc(38.32,5.49) 38.42,5.65 38.74,5.96 arc(38.78,5.95) 38.82,5.94 39.12,5.94 arc(39.26,6) 39.32,6.14 39.32,6.33 arc(39.36,6.53) USB1.10
CCM: length 9.1
  Top Layer w0.15: 3.23,0.63 3.25,0.63 arc(3.42,0.6) v3(3.57,0.5) ; U1.11 10.61,3.57 arc(10.59,3.7) v3(10.52,3.8)
  Bottom Layer w0.15: v3(10.52,3.8) 7.93,3.8 arc(6.95,3.61) 6.13,3.06 v3(3.57,0.5)
CR1: length 0.7
  Top Layer w0.2: 12.32,4.69 R5.2
DATA+: length 21.8
  Top Layer w0.2: 38.48,6.69 38.45,6.69 arc(38.39,6.6) 38.33,6.52 38.33,6.14 arc(38.27,6) 38.13,5.94 37.83,5.94 arc(37.69,6) 37.63,6.14 37.63,6.66 arc(37.63,6.67) 37.62,6.69 37.48,6.69 ; v3(22.37,6.21) 21.85,6.21 arc(21.84,6.21) 21.84,6.22
  Inner2 w0.2: v3(22.37,6.21) 22.42,6.26 arc(22.6,6.52) 22.66,6.82 22.66,6.87 arc(22.66,6.92) 22.69,6.96 22.72,6.99 arc(23.47,6.72) 24.07,7.25 30.54,7.25 arc(30.6,7.24) 30.66,7.2 30.71,7.15 arc(30.79,6.69) 31.24,6.58 32.3,5.52 arc(32.69,4.79) 33.49,4.54 33.72,4.54 arc(34.18,4.58) 34.63,4.69 arc(35.33,4.81) 35.75,5.38 arc(35.76,5.38) 35.76,5.39 36.73,6.36 arc(36.91,6.48) 37.11,6.52 37.22,6.52 arc(37.32,6.5) 37.4,6.44 38,5.85 arc(38.02,5.82) v3(38.02,5.79)
DATA-: length 21.9
  Top Layer w0.2: v3(21.97,7.15) 21.97,7.03 arc(21.93,6.86) 21.84,6.72 ; 36.96,6.69 arc(37.05,6.75) 37.11,6.84 37.11,7.24 arc(37.17,7.38) 37.31,7.44 37.61,7.44 arc(37.75,7.38) 37.81,7.24 37.81,6.84 arc(37.87,6.75) 37.96,6.69
  Inner2 w0.2: v3(21.97,7.15) 22.1,7.29 arc(22.26,7.4) 22.46,7.44 22.52,7.44 arc(22.66,7.47) 22.78,7.55 22.81,7.57 arc(22.84,7.59) 22.88,7.6 22.92,7.6 arc(23.21,7.07) 23.74,7.37 arc(23.75,7.49) 23.74,7.6 30.54,7.6 arc(30.74,7.56) 30.91,7.45 30.96,7.39 arc(31.4,7.29) 31.51,6.85 32.62,5.74 arc(32.64,5.71) 32.64,5.68 32.64,5.64 arc(32.89,5.09) 33.46,4.89 33.72,4.89 arc(34.17,4.94) 34.62,5.06 arc(35.14,5.11) 35.43,5.56 arc(35.47,5.6) 35.51,5.64 36.48,6.61 arc(36.77,6.8) 37.11,6.87 37.23,6.87 arc(37.32,6.89) 37.4,6.94 arc(37.45,7.02) 37.47,7.11 v3(37.47,7.59)
DTR: length 5.6
  Top Layer w0.2: v3(19.09,7.2) 19.3,7.2 arc(19.52,7.24) U3.12
  Inner1 w0.2: v3(19.09,7.2) 20.4,7.2 arc(20.67,7.07) 20.96,7.16 arc(21.27,7.09) 21.58,6.97 arc(21.75,6.78) 22.01,6.73 arc(22.09,6.66) 22.18,6.59 arc(22.67,6.52) 22.76,6.03 v3(23.2,5.59)
EN: length 4.9
  Top Layer w0.2: 11.11,2.54 11.11,3.29 arc(11,2.7) R4.2 ; 11.11,2.54 11.11,1.64 arc(11.12,1.62) 11.12,1.59 11.12,1.09 arc(11.09,0.99) 11,0.91 arc(10.88,0.7) R3#2.2 ; 11.11,2.54 arc(11.27,2.44) 11.46,2.4 11.62,2.4 arc(11.72,2.42) D3.1
EN1: length 2.1
  Top Layer w0.3: R13.2 18.04,3.35 arc(18.11,3.37) C13.2 18.62,2.94 arc(18.83,2.8) U2.5
EN-ESP: length 10
  Top Layer w0.2: v3(23.33,7.48) Q2.2 ; U4.7 27.8,0.89 arc(27.68,0.71) v3(27.64,0.5)
  Bottom Layer w0.2: v3(27.64,0.5) 25.21,2.93 arc(25.06,3.16) 25,3.44 25,3.74 arc(24.63,4.01) 24.56,4.47 arc(24.14,4.74) 24.23,5.23 arc(24.19,5.42) 24.09,5.58 24.07,5.59 arc(23.52,6.42) 23.33,7.39 v3(23.33,7.48)
FB: length 1.6
  Top Layer w0.15: U1.4 10.61,6.5 arc(10.59,6.55) 10.58,6.61 10.58,7.11 arc(10.59,7.16) 10.61,7.21 10.61,7.37 arc(10.75,7.46) 10.92,7.49 11,7.49
  vias: v3(10.74,7.49)
FB1: length 2.2
  Top Layer w0.3: R15.2 R16.2 R14.1 22.09,2.11 arc(22.08,2.11) U2.3
FREQ: length 0.7
  Top Layer w0.2: U1.5 10.11,6.79 arc(10.11,6.83) R10.1
GPIO0: length 1.6
  Top Layer w0.2: Q3.2 25.91,1.52 arc(26.25,1.58) 26.54,1.78 26.85,2.09 arc(26.88,2.1) U4.4
LAN-IN: length 37.7
  Top Layer w0.4: U4.1 25.47,3.54 arc(25.23,3.9) v2(25.15,4.32) 25.15,5.82 arc(25.17,5.96) RF1.1
  Top Layer w0.6: L2.2 57.49,0.89 arc(58.47,1.08) 59.29,1.63 59.44,1.78 arc(59.46,1.82) 59.47,1.87 59.47,2.16 ; v4(53.09,2.41) 53.42,2.41 arc(54.13,2.27) C23.1 55.36,1.25 arc(55.75,0.98) L2.1
  Bottom Layer w0.8: 52.7,2.34 44.53,2.34 arc(43.55,2.53) 42.73,3.08 42.24,3.57 arc(41.41,4.12) 40.44,4.32 v2(25.15,4.32)
  vias: v1(37.5,2.98)
LC: length 15.5
  Top Layer w0.2: 31.11,2.46 31.4,2.17 arc(31.44,2.13) 31.46,2.08
  Inner1 w0.2: v3(31.47,2.01) 33.44,3.98 NOREF#3.2
LED: length 0.9
  Top Layer w0.2: R16#2.1 16.84,7.31 arc(16.84,7.34) LED1.1
NC1: length 1
  Top Layer w0.3: U2.6 18.97,2.1 arc(18.78,2.12) 18.59,2.17 arc(18.5,2.25) 18.38,2.28 18.36,2.28 arc(18.26,2.35) C13.1
OUT-3.3V: length 80.6
  Top Layer w0.2: v3(17.46,7.37) LED1.2 ; U4.11 30.24,1.4 arc(30.26,1.4) 30.28,1.4 30.39,1.28 arc(30.53,1.23) 30.68,1.28 30.7,1.31 arc(30.89,1.2) v3(31.06,1.06) 31.15,0.97 arc(31.29,0.76) C21.2 ; 24.84,2.97 24.66,3.15 arc(24.59,3.2) C19#3.2 arc(24.67,3.08) 24.84,2.97 ; 24.84,2.97 25.51,2.3 ; R15.1 R16.1 ; C17#2.2 17.63,4.93 arc(17.96,4.72) 18.34,4.64 18.38,4.64 arc(18.41,4.64) 18.43,4.64 arc(18.53,4.58) 18.58,4.49 arc(18.58,4.48) 18.58,4.47 18.58,4.45 arc(18.63,4.4) 18.69,4.37 arc(18.76,4.35) 18.82,4.32 arc(18.87,4.31) 18.93,4.3 19.68,4.3 20.16,3.83 arc(20.3,3.73) 20.46,3.69 ; 25.51,2.3 arc(25.44,2.29) C19#2.2 26.12,2.29 arc(26.35,2.33) U4.3 ; 25.51,2.3 arc(25.71,2.37) 25.87,2.49 U4.2 ; 24.38,3.09 24.19,3.09 arc(23.92,3.14) 23.68,3.27 ; C17.2 arc(23.62,3.65) 23.62,3.62 ; U4.17 arc(32.05,3.85) 32.13,3.44 32.13,3.39 arc(32.14,3.34) 32.17,3.3 32.29,3.18 arc(32.35,3.04) 32.29,2.9 32.21,2.82 arc(32.15,2.73) 32.13,2.63 C20#2.2 32.05,1.8 arc(31.87,1.59) v3(31.63,1.46)
  Top Layer w0.3: 22.13,0.46 22.02,0.46 v3(21.97,0.5) 22.07,0.6 U2.1 U2.2 ; C20.2 v3(20.52,3.68) C19.2 ; 23.62,3.62 v3(23.62,3.32) C18.2 ; 22.13,0.45 arc(22.5,0.37) R16.1
  Top Layer w0.5: R19.2 43.61,3.63 v2(43.61,3.5)
  Inner1 w0.2: v3(31.06,1.06) 25.19,1.06 arc(24.77,1.44) 24.34,1.06 23.32,1.06 arc(22.59,0.91) v3(21.97,0.5) ; v3(23.62,3.32) 24.58,2.37 arc(25.4,1.82) 26.37,1.62 26.54,1.46 v3(31.63,1.46)
  Inner2 w0.4: v2(43.61,3.5) 24.56,3.5 24.16,3.1 arc(23.87,3.16) v3(23.62,3.32)
  Bottom Layer w0.2: 21.97,0.59 21.97,1.18 arc(21.78,2.15) 21.23,2.97 v3(20.52,3.68) arc(20.91,3.42) 21.39,3.32 v3(23.62,3.32) 22.71,2.42 arc(22.18,1.57) 21.97,0.59 ; 21.97,0.59 21.97,0.51 ; 21.97,0.59 arc(21.97,0.59) 21.97,0.59 ; 21.97,0.59 arc(21.96,0.62) 21.93,0.63 15.93,0.63 arc(15.76,0.67) 15.62,0.76 15.55,0.84 arc(15.41,1.04) 15.37,1.27 15.37,4.22 arc(15.56,5.19) 16.11,6.01 v3(17.46,7.37) ; v3(21.97,0.5) 21.97,0.51 ; v3(21.97,0.5) arc(21.97,0.51) 21.97,0.51 ; v3(21.97,0.5) arc(21.98,0.54) 21.97,0.59 ; 21.97,0.51 arc(21.97,0.55) 21.97,0.59
PG: length 5.2
  Top Layer w0.2: R3.2 8,6.91 arc(7.91,6.77) 7.87,6.6 7.87,6.23 arc(7.88,6.2) 7.9,6.17 7.91,6.16 arc(7.91,6.16) 7.91,6.15 7.91,6.14 arc(7.97,6) 8.11,5.94 8.35,5.94 arc(8.58,5.87) 8.82,5.84 9.29,5.84 arc(9.35,5.7) 9.49,5.64 9.74,5.64 arc(9.81,5.65) 9.86,5.68 arc(9.92,5.65) 9.99,5.64 10.24,5.64 arc(10.31,5.65) 10.36,5.68 arc(10.42,5.65) 10.49,5.64 10.74,5.64 arc(10.88,5.7) 10.94,5.84 10.94,6.05 arc(11.03,6.12) U1.3
R3: length 1.4
  Top Layer w0.3: R7.2 arc(13.42,6.91) 13.44,6.98 C7.2 14.11,7.49 arc(14.17,7.5) R9.1
R6: length 2.5
  Top Layer w0.3: R6.2 C7.1 12.47,6.98 arc(12.49,6.91) 12.52,6.86 12.52,6.78 arc(12.57,6.55) 12.7,6.35 arc(12.92,6.2) 13.17,6.15 R8.1
R7: length 2.9
  Top Layer w0.15: R10.2 9.11,6.75 arc(9.05,6.71) v3(8.98,6.69) ; R11.1 11.26,6.86 arc(11.27,6.86) v3(11.27,6.86)
  Bottom Layer w0.15: v3(11.27,6.86) 9.37,6.86 arc(9.16,6.81) v3(8.98,6.69)
RTS: length 5.6
  Top Layer w0.2: v3(18.68,6.72) 19.05,6.72 arc(19.05,6.72) U3.13
  Inner1 w0.2: v3(23.2,4.7) 21.75,4.7 arc(20.78,4.89) 19.95,5.44 v3(18.68,6.72)
RX: length 7.2
  Top Layer w0.2: 21.84,5.22 21.97,5.22 arc(22.09,5.19) v3(22.19,5.13)
  Top Layer w0.3: v3(27.4,6.18) 27.6,5.98 arc(27.61,5.98) U4.27
  Inner2 w0.2: v3(27.4,6.18) 27.4,6.12 27.28,5.99 26.01,5.99 25.87,6.14 25.87,6.36 25.73,6.51 24.48,6.51 24.34,6.36 24.34,6.14 24.2,5.99 23.33,5.99 arc(22.92,5.91) 22.78,5.51 22.53,5.27 arc(22.37,5.16) v3(22.19,5.13)
SW: length 5.8
  Top Layer w0.2: 12.32,5.73 11.95,5.36 arc(11.68,5.18) U1.2
  Top Layer w0.3: L1.1 13.26,3.76 12.84,4.18 12.84,4.97 arc(12.77,5.14) 12.59,5.22 12.05,5.22 arc(11.91,5.18) 11.82,5.07 arc(11.59,5.1) U1.2
TX: length 7.5
  Top Layer w0.2: v3(21.37,4.22) 21.33,4.26 arc(21.23,4.4) U3.4
  Top Layer w0.3: v3(27.42,5.46) 27.27,5.6 arc(27.26,5.61) U4.28
  Inner2 w0.2: v3(27.42,5.46) 27.15,5.46 arc(27.03,5.48) 26.93,5.55 arc(26.82,5.62) 26.7,5.64 23.62,5.64 arc(23.46,5.25) 23.04,5.19 22.21,4.36 arc(21.94,4.18) 21.62,4.12 arc(21.48,4.14) v3(21.37,4.22)
V: length 2.6
  Top Layer w0.5: 45.59,0.98 44.91,1.66 arc(44.23,2.12) R20.2
VOUT-5V: length 79.3
  Top Layer w0.2: 20.7,4.71 20.7,4.34 arc(20.69,4.31) v3(20.67,4.28) ; C18#2.2 18.22,4.11 arc(18.4,3.99) v3(18.6,3.95) ; U3.9 21.21,7.36 arc(21.39,7.4) v3(21.55,7.5)
  Top Layer w0.3: 15.11,5.87 C11.1 C12.1 ; 15.11,5.87 15.11,5.82 ; 15.11,5.87 15.39,6.14 arc(15.4,6.16) v3(15.41,6.19) ; 15.11,5.87 C9.2 arc(15.1,5.83) 15.11,5.82 ; U2.8 U2.7 18.92,1.45 arc(18.49,1.54) C14.2 ; U2.8 18.96,0.8 arc(18.51,0.89) C15.2 ; U2.8 arc(18.75,0.58) 18.37,0.51 C16.2 C15.2 ; C15.2 C14.2 ; C8.1 15.4,5.82 ; C8.1 C12.1 ; C8.1 arc(15.74,5.84) 15.73,5.87 v3(15.41,6.19) ; 15.4,5.82 15.15,5.82 arc(15.13,5.82) 15.11,5.82 ; 15.4,5.82 arc(15.4,5.82) 15.41,5.82 v3(15.41,6.19) ; 15.11,5.82 15.11,5.02 arc(15.11,4.98) C10.2 ; C12.1 15.45,6.21 arc(15.43,6.19) v3(15.41,6.19) ; v2(16.03,1.24) 16.62,1.84 arc(16.66,1.89) 16.67,1.96 16.67,2.03 arc(16.74,2.2) 16.92,2.28 arc(17.05,2.3) 17.16,2.38 R13.1 17.49,2.27 arc(17.6,2.2) 17.66,2.1 17.69,2.07 arc(17.73,2.01) 17.79,1.97 17.87,1.89 arc(17.99,1.81) C14.2 ; v3(14.22,6.94) R9.2
  Top Layer w0.5: v2(43.43,1.47) R20.1
  Inner1 w0.4: v2(14.43,1.24) v2(16.03,1.24) ; v2(14.43,1.24) v2(13.63,1.24) 13.63,0.5 ; v2(14.43,1.24) 14.43,0.5
  Inner2 w0.4: v2(14.43,1.24) 14.43,0.5 ; v2(14.43,1.24) v2(16.03,1.24) 16.95,1.24 arc(17.49,1.69) 18.03,1.24 20.09,1.24 arc(20.64,0.7) 21.19,1.24 24.29,1.24 arc(24.77,1.54) 25.24,1.24 30.57,1.24 arc(30.78,1.51) 31.11,1.58 arc(31.12,1.6) 31.12,1.61 arc(31.07,2.36) 31.81,2.41 arc(31.97,2.16) 31.97,1.86 arc(32.13,1.62) 32.14,1.34 arc(32.13,1.29) 32.11,1.24 32.53,1.24 arc(33.39,0.69) 34.26,1.24 41.18,1.24 arc(42.04,0.69) 42.91,1.24 arc(43.19,1.31) v2(43.43,1.47) ; v2(14.43,1.24) v2(13.63,1.24) 13.63,0.5
  Bottom Layer w0.2: v3(21.55,7.5) 21.42,7.37 arc(20.87,6.55) 20.67,5.57 v3(20.67,4.28) arc(20.56,4.19) 20.44,4.1 arc(20.34,4.07) 20.25,4.01 arc(20.06,3.96) 19.86,3.95 v3(18.6,3.95)
  Bottom Layer w0.3: v2(14.43,1.24) 14.43,4.16 arc(14.62,5.13) 15.17,5.95 v3(15.41,6.19) ; v3(18.6,3.95) 18.5,3.85 arc(18.46,3.82) 18.42,3.81 16.44,3.81 arc(16.27,3.78) 16.13,3.68 arc(16.05,3.57) 16.03,3.43 v2(16.03,1.24) ; v2(13.63,1.24) 13.63,5.49 arc(13.78,6.27) v3(14.22,6.94)
  Bottom Layer w0.4: 14.43,0.5 v2(14.43,1.24) v2(13.63,1.24) 13.63,0.5
  vias: v2(13.63,0.44) v2(14.43,0.44)

## Copper pours and planes (outline as drawn; the poured copper is in the pictures)
GND on Top Layer: -0.51,8.51 47.12,8.51 47.12,-0.25 -0.51,-0.25
GND on Bottom Layer: -0.25,8.25 47.08,8.25 47.08,-0.21 -0.25,-0.21
GND on Inner1: -0.64,8.38 47.12,8.38 47.12,-0.51 -0.64,-0.51
GND on Inner2: -1.14,8.89 47.12,8.89 47.12,-0.89 -1.14,-0.89

Small or netless copper shapes (teardrops, artwork), in the pictures only: 170 on Top Layer, 30 on Bottom Layer, 20 on Inner1, 17 on Inner2
